# EAGLE design DotLight (EAGLE 7.7.0)

## Sheet 1 of 3
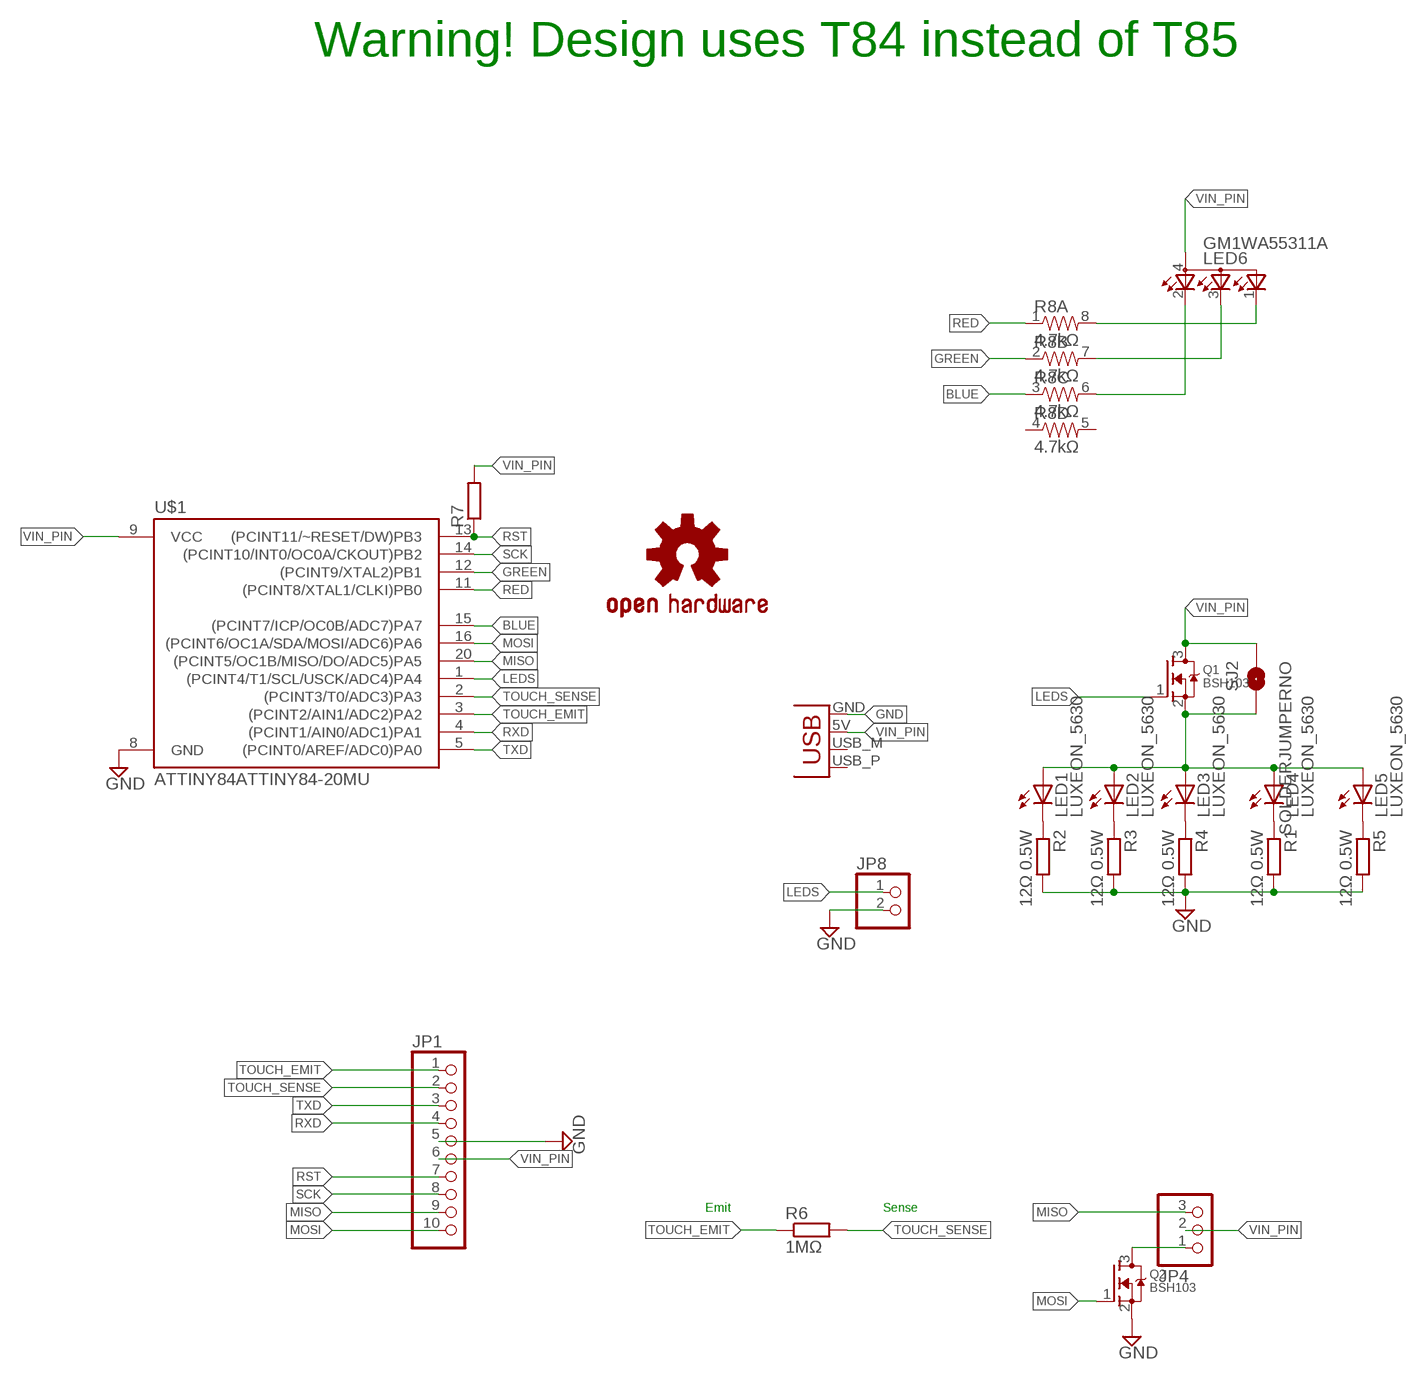
[diagram p0: schematic, sheet 1]

### Parts
JP1  PINHD-1X10  [1X10]
JP3  USBPCB  [USB-A-PCB]
JP4  PINHD-1X3  [1X03]
JP8  PINHD-1X2  [1X02]
LED1  LUXEON_5630  [LUXEON_5630]
LED2  LUXEON_5630  [LUXEON_5630]
LED3  LUXEON_5630  [LUXEON_5630]
LED4  LUXEON_5630  [LUXEON_5630]
LED5  LUXEON_5630  [LUXEON_5630]
LED6  GM1WA55311A  [GM1WA55311A]
LOGO1  OSHW-LOGOS  [OSHW-LOGO-S]
Q1  BSH103  MOSFET-NREFLOW  [SOT23]
Q2  BSH103  MOSFET-NREFLOW  [SOT23]
R1  12Ω 0.5W  R-EU_R1210  [R1210]
R2  12Ω 0.5W  R-EU_R1210  [R1210]
R3  12Ω 0.5W  R-EU_R1210  [R1210]
R4  12Ω 0.5W  R-EU_R1210  [R1210]
R5  12Ω 0.5W  R-EU_R1210  [R1210]
R6  1MΩ  R-EU_R1206  [R1206]
R7  R-EU_R0603  [R0603]
R8  4.7kΩ  RESISTOR-ARRAY0603-ARV  [0603-ARV]
SJ2  SOLDERJUMPERNO  [SJ_2S-NO]
U$1  ATTINY84ATTINY84-20MU  [QFN20]

### Nets
BLUE: R8.3 U$1.15((PCINT7/ICP/OC0B/ADC7)PA7)
GND: JP1.5 JP3.GND JP8.2 Q2.2(S) R1.2 R2.2 R3.2 R4.2 R5.2 U$1.8(GND)
GO: LED1.A LED2.A LED3.A LED4.A LED5.A Q1.2(S) SJ2.2
GREEN: R8.2 U$1.12((PCINT9/XTAL2)PB1)
LED_R1: LED4.C R1.1
LED_R2: LED1.C R2.1
LED_R3: LED2.C R3.1
LED_R4: LED3.C R4.1
LED_R5: LED5.C R5.1
LEDS: JP8.1 Q1.1(G) U$1.1((PCINT4/T1/SCL/USCK/ADC4)PA4)
MISO: JP1.9 JP4.3 U$1.20((PCINT5/OC1B/MISO/DO/ADC5)PA5)
MOSI: JP1.10 Q2.1(G) U$1.16((PCINT6/OC1A/SDA/MOSI/ADC6)PA6)
N$1: LED6.2(CRED) R8.6
N$2: LED6.3(CBLUE) R8.7
N$3: JP4.1 Q2.3(D)
N$4: LED6.1(CGREEN) R8.8
RED: R8.1 U$1.11((PCINT8/XTAL1/CLKI)PB0)
RST: JP1.7 R7.1 U$1.13((PCINT11/~RESET/DW)PB3)
RXD: JP1.4 U$1.4((PCINT1/AIN0/ADC1)PA1)
SCK: JP1.8 U$1.14((PCINT10/INT0/OC0A/CKOUT)PB2)
TOUCH_EMIT: JP1.1 R6.1 U$1.3((PCINT2/AIN1/ADC2)PA2)
TOUCH_SENSE: JP1.2 R6.2 U$1.2((PCINT3/T0/ADC3)PA3)
TXD: JP1.3 U$1.5((PCINT0/AREF/ADC0)PA0)
VIN_PIN: JP1.6 JP3.5V(VBUS) JP4.2 LED6.4(A) Q1.3(D) R7.2 SJ2.1 U$1.9(VCC)
Unconnected: JP3.USB_M(D-) JP3.USB_P(D+) R8.4 R8.5

### Notes on the sheet
- Warning! Design uses T84 instead of T85
- Emit | Sense

## Sheet 2 of 3
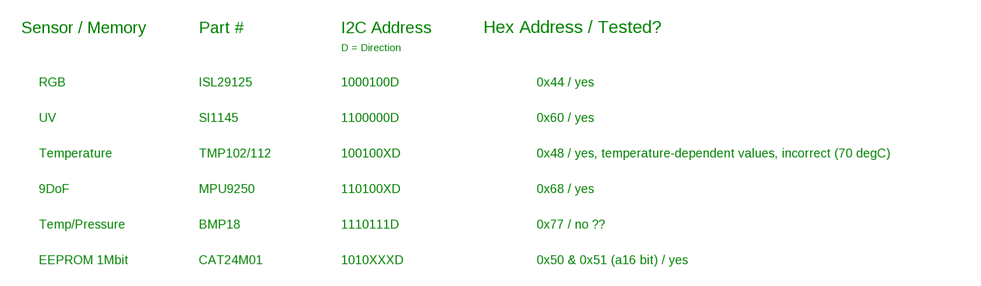
[diagram p1: schematic, sheet 2]

### Notes on the sheet
- Sensor / Memory | Part # | I2C Address | Hex Address / Tested?
- D = Direction
- RGB | ISL29125 | 1000100D | 0x44 / yes
- UV | SI1145 | 1100000D | 0x60 / yes
- Temperature | TMP102/112 | 100100XD | 0x48 / yes, temperature-dependent values, incorrect (70 degC)
- 9DoF | MPU9250 | 110100XD | 0x68 / yes
- Temp/Pressure | BMP18 | 1110111D | 0x77 / no ??
- EEPROM 1Mbit | CAT24M01 | 1010XXXD | 0x50 & 0x51 (a16 bit) / yes

## Sheet 3 of 3
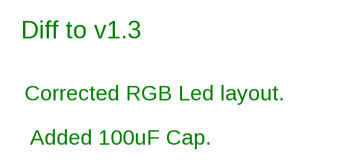
[diagram p2: schematic, sheet 3]

### Notes on the sheet
- Diff to v1.3
- Corrected RGB Led layout.
- Added 100uF Cap.

## Library data of the parts
JP1 = pinhead:PINHD-1X10: PIN HEADER
JP3 = Spark:USB
JP4 = pinhead:PINHD-1X3: PIN HEADER
JP8 = pinhead:PINHD-1X2: PIN HEADER
LED1-LED5 = HighPowerLed:LUXEON_5630: LUXEON 5630 Mid-Power LEDs SD201 Source: Data sheet <www.philipslumileds.com/uploads/351/DS201-pdf> Lumileds 5630 Datasheet DS201 20130228 ©2013 Philips Lumileds Lighting Company.
LED6 = led:GM1WA55311A: Chip LED RGB Source: http://document.sharpsma.com/files/GM1WA55311A_SS.pdf
LOGO1 = Particle-Devices:OSHW-LOGO: Open Source Hardware Logo This logo indicates the piece of hardware it is found on incorporates a OSHW license and/or adheres to the definition of open source hardware found here: http://freedomdefined.org/OSHW
Q1 Q2 = adafruit:MOSFET-N: N-Channel Mosfet 2N7002E - 60V 260mA SOT23 [Digikey: 2N7002ET1GOSTR-ND] - REEL BSH103 - 30V 850mA SOT23 [Digikey: 568-5013-1-ND]
R1-R6 = resistor:R-EU_: RESISTOR, European symbol
R7 = rcl:R-EU_: RESISTOR, European symbol
R8 = SparkFun:RESISTOR-ARRAY: Array Chip Resistor Source: RS Component / Phycomp
SJ2 = SparkFun-Retired:SOLDERJUMPER: Solder Jumper Standard SMD solder jumper. Used to automate production. Two varients : Normally Open and Normally Closed are the same, but have different paste layers. NC will have a large amount of paste and should jumper during reflow.
U$1 = SparkFun-IC-Microcontroller:ATTINY84: Atmel 14-pin 2/4/8kB flash uC Datasheet <https://cdn.sparkfun.com/datasheets/Widgets/doc8006.pdf> SparkFun Products Tiny AVR Programmer <https://www.sparkfun.com/products/11801> (PGM-11801) SparkFun Servo Trigger - Continuous Rotation <https://www.sparkfun.com/products/13872> (WIG-13872) SparkFun Servo Trigger <https://www.sparkfun.com/products/13118> (WIG-13118)

## Board
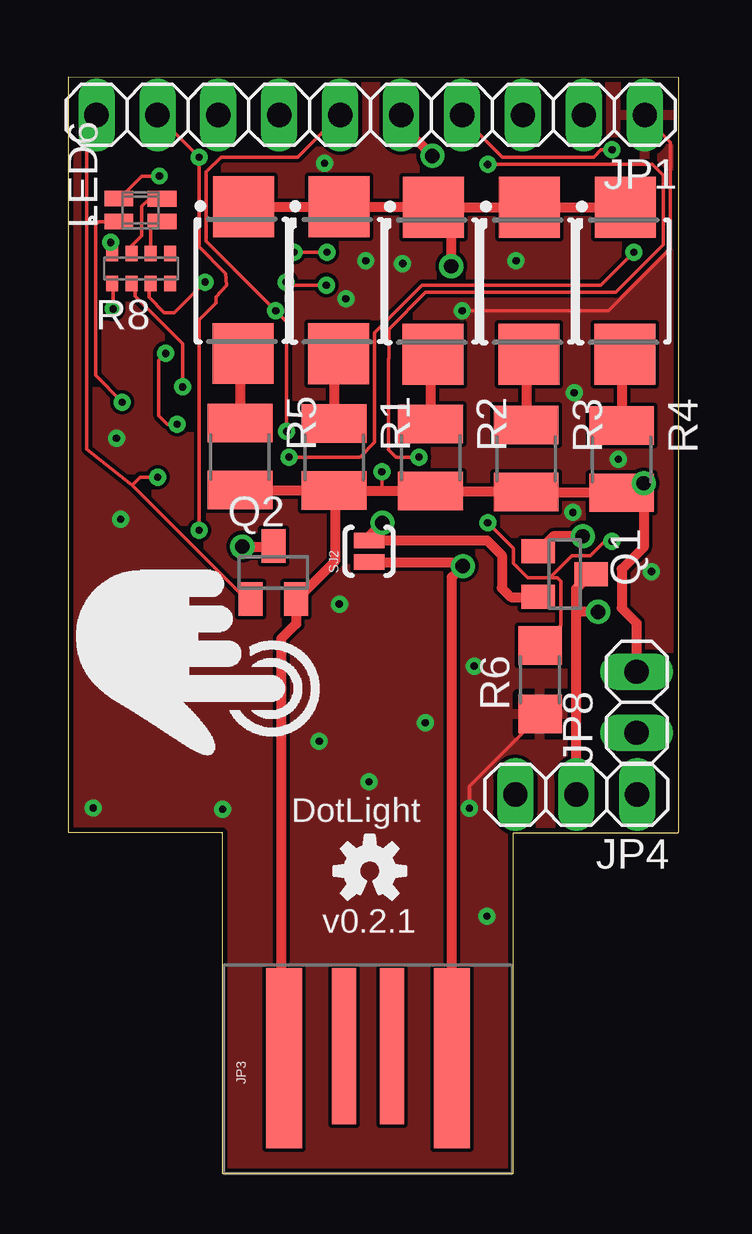
[diagram p3: board, top side]
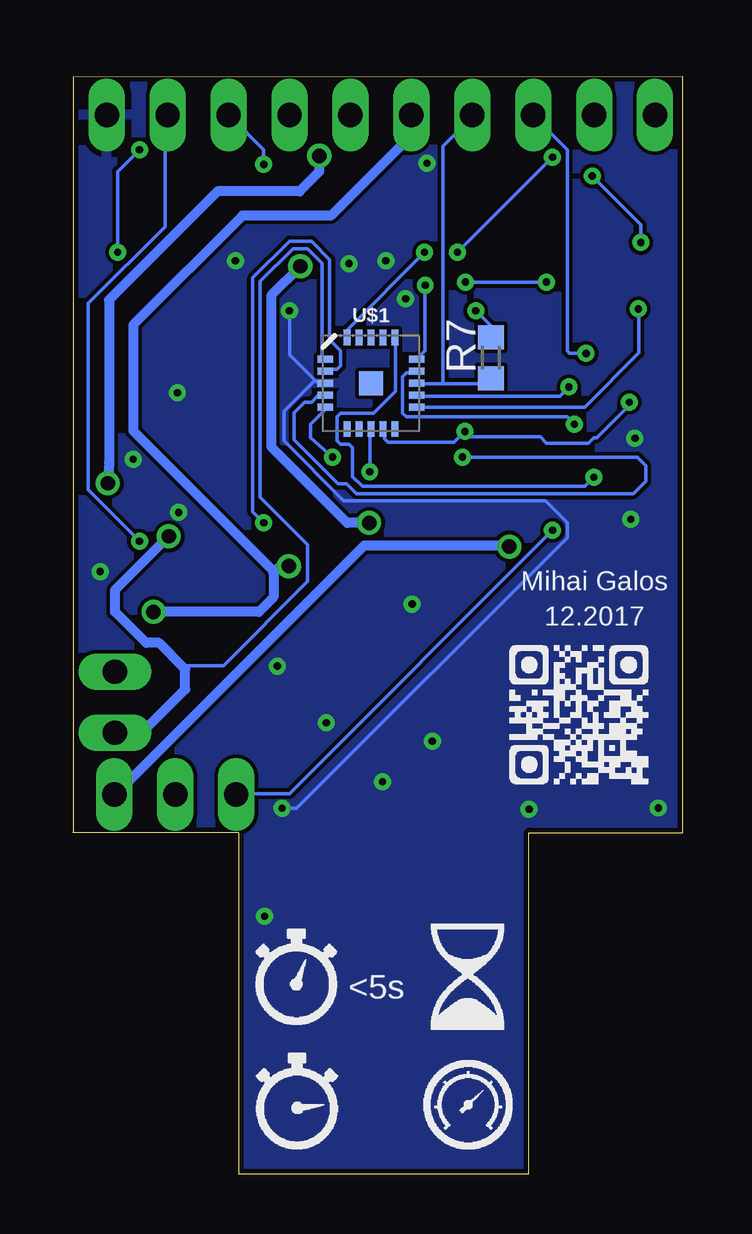
[diagram p4: board, bottom side, seen from below]

Size 25.43 x 45.71 mm. Coordinates in mm from the lower left corner, seen from the top.
Outline: 0,14.22 0,45.71 25.43,45.7 25.42,14.23
Outline: 6.42,14.21 6.42,0 18.52,0 18.52,14.21
Outline: 18.52,14.22 25.42,14.22 25.42,14.24
Outline: 6.42,14.22 0,14.22 0,14.23
Copper layers (1*16): Top 0.035mm / dielectric 1.5mm / Bottom 0.035mm
Design rules "Mihai_default": minimum track width 6mil, minimum drill 0.3mm, track to track 6mil, track to pad 6mil, pad to pad 6mil, via to via 6mil, smd to smd 6mil, copper to edge 8mil, drill to drill 8mil, minimum pad ring 10mil, minimum via ring 8mil, stop-mask expansion 4mil, vias tented up to drill 0mil, thermal gap 10mil

### Footprints (pad centres in the part's own frame; a part is rotated, then mirrored left to right if it is on the bottom)
1X10 = drill 1.016 long: 1 -11.43,0; 2 -8.89,0; 3 -6.35,0; 4 -3.81,0; 5 -1.27,0; 6 1.27,0; 7 3.81,0; 8 6.35,0; 9 8.89,0; 10 11.43,0
USB-A-PCB = smd 7.5 x 1.5: 5V -0.2,-3.5; GND -0.2,3.5 | smd 6.5 x 1: USB_M 0.3,-1; USB_P 0.3,1
1X03 = drill 1.016 long: 1 -2.54,0; 2 0,0; 3 2.54,0
1X02 = drill 1.016 long: 1 -1.27,0; 2 1.27,0
LUXEON_5630 = smd 2.54 x 2.54: A -3.073,0.076; C 3.048,0.051
GM1WA55311A = smd 0.65 x 1.2: 1 0.477,0.9; 2 -0.475,-0.9; 3 0.475,-0.9; 4 -0.477,0.9
SOT23 = smd 1 x 1.4: 1 -0.95,-1.1; 2 0.95,-1.1; 3 0,1.1
R1210 = smd 1.6 x 2.7: 1 -1.4,0; 2 1.4,0
R1206 = smd 1.6 x 1.803: 1 -1.422,0; 2 1.422,0
R0603 = smd 1 x 1.1: 1 -0.85,0; 2 0.85,0
0603-ARV = smd 0.5 x 0.65: 1 -1.2,-0.625; 2 -0.4,-0.625; 3 0.4,-0.625; 4 1.2,-0.625; 5 1.2,0.625; 6 0.4,0.625; 7 -0.4,0.625; 8 -1.2,0.625
SJ_2S-NO = smd 0.635 x 1.27: 1 -0.45,0; 2 0.45,0
QFN20 = smd 1 x 1: 0 0,0 | smd 0.65 x 0.3: 1 -1.9,1; 2 -1.9,0.5; 3 -1.9,0; 4 -1.9,-0.5; 5 -1.9,-1; 11 1.9,-1; 12 1.9,-0.5; 13 1.9,0; 14 1.9,0.5; 15 1.9,1 | smd 0.3 x 0.65: 6 -1,-1.9; 7 -0.5,-1.9; 8 0,-1.9; 9 0.5,-1.9; 10 1,-1.9; 16 1,1.9; 17 0.5,1.9; 18 0,1.9; 19 -0.5,1.9; 20 -1,1.9

### Placement (x,y rotation side)
JP1  12.6,44.12 180 top
JP3  12.48,5.01 90 top
JP4  21.17,15.8 180 top
JP8  23.69,19.65 90 top
LED1  15.14,37.2 270 top
LED2  19.14,37.2 270 top
LED3  23.14,37.2 270 top
LED4  11.2,37.22 270 top
LED5  7.23,37.23 270 top
LED6  3,40.15 90 top
LOGO1  12.56,12.61 0 top
Q1  20.68,24.99 270 top
Q2  8.54,25.06 0 top
R1  11.07,29.87 270 top
R2  15.09,29.85 270 top
R3  19.08,29.81 270 top
R4  23.06,29.78 270 top
R5  7.15,29.89 270 top
R6  19.66,20.59 90 top
R7  8.01,34 90 bottom
R8  3.03,37.71 0 top
SJ2  12.53,25.94 90 top
U$1  13.01,32.94 0 bottom

### Tracks (layer width: path | path; a pad name or v marks a point on that pad's centre or on a via)
BLUE  (via drill 0.3)
  Top 0.152: v10.75,37.03 9.2,37.03 v9.07,37.15 | v5.69,37.15 5.67,37.15 4.4,35.88 3.99,35.88 3.36,36.52 3.36,37.02 R8.3
  Bottom 0.152: U$1.15 10.75,34.3 v10.75,37.03 | v9.07,37.15 v5.69,37.15
GND  (via drill 0.3, 0.6)
  Top 0.152: 13.06,28.47 v13.06,29.25
  Top 0.406: R5.2 11.07,28.49 R1.2 | R1.2 13.06,28.47 15.09,28.47 R2.2 19.08,28.45 R3.2 23.06,28.41 R4.2 23.98,28.38 v23.98,28.77 23.98,26.1 23.07,25.19 23.07,23.57 23.69,22.94 JP8.2 | R1.2 11.13,28.41 11.13,25.55 9.54,23.96 Q2.2 9.49,22.92 8.87,22.29 8.87,4.92 JP3.GND | JP1.5 13.87,43.71 v15.17,42.41
  Bottom 0.152: v13.06,29.25 13.06,30.93 U$1.8
  Bottom 0.406: v15.17,42.41 15.17,41.75 15.98,40.94 19.41,40.94 23.93,36.42 23.93,29.64 v23.98,28.77
GO  (via drill 0.6)
  Top 0.406: LED5.A 11.28,40.3 LED4.A 15.22,40.29 LED1.A | LED1.A LED2.A LED3.A | Q1.2 19.57,24.02 18.45,24.02 18.06,24.4 18.06,25.77 17.45,26.39 SJ2.2 12.53,26.57 v13.09,27.12 | v15.96,37.81 15.96,39.53 LED1.A
  Bottom 0.406: v13.09,27.12 14,27.12 17.15,30.27 17.15,36.62 v15.96,37.81
GREEN  (via drill 0.3)
  Top 0.152: v4.76,32.79 4.76,34.59 2.77,36.57 2.77,36.94 R8.2
  Bottom 0.152: U$1.12 10.9,32.44 10.9,32.4 5.13,32.39 v4.76,32.79
LED_R1
  Top 0.406: LED4.C 11.07,34.17 R1.1
LED_R2
  Top 0.406: LED1.C 15.09,34.15 R2.1
LED_R3
  Top 0.406: LED2.C 19.08,34.15 R3.1
LED_R4
  Top 0.406: LED3.C 23.06,34.15 R4.1
LED_R5
  Top 0.406: LED5.C 7.15,34.18 R5.1
LEDS  (via drill 0.6)
  Top 0.406: v21.44,26.56 20.21,26.56 Q1.1
  Bottom 0.152: U$1.1 15.04,33.98 15.04,37.94 15.65,38.55 16.26,38.55 17.63,37.18 17.63,28.19 15.65,26.21 15.65,24.68 19.16,21.18 20.68,21.18 20.8,21.06
  Bottom 0.406: v21.44,26.56 23.69,24.31 23.68,24.3 23.68,23.41 22.38,22.12 21.85,22.12 20.8,21.06 20.76,21.02 20.76,20.19 22.57,18.38 JP8.1
MISO  (via drill 0.3)
  Top 0.152: v9.4,38.4 v10.77,38.4 | JP1.9 3.76,44.04 v5.44,42.36 5.44,38.63 6.56,37.51 6.58,37.03 6.15,36.54 6.15,36.29 5.44,35.58 v5.44,26.82
  Bottom 0.152: v10.77,38.4 13.98,35.2 13.98,34.89 U$1.20 | v5.44,42.36 v9.4,38.4 | v5.44,26.82 16.41,15.84 18.55,15.84 JP4.3
MOSI  (via drill 0.3)
  Top 0.152: 2.65,28.7 0.77,30.19 0.77,44.06 JP1.10 | 2.65,28.7 7.27,24.07 7.57,24.07 Q2.1 | v3.71,29.03 2.98,29.03 2.65,28.7
  Bottom 0.152: U$1.16 11.99,34.74 11.99,32.61 12.91,31.69 14.28,31.69 14.43,31.54 14.43,30.55 14.28,30.4 13.92,30.4 13.77,30.25 13.77,29.05 13.37,28.64 4.09,28.64 v3.71,29.03 | 1.17,44.04 JP1.10
N$1
  Top 0.152: LED6.2 3.43,39.68 R8.6
N$2
  Top 0.152: R8.7 2.63,38.66 3.05,39.08 3.05,40.3 3.33,40.58 3.86,40.58 LED6.3
N$3  (via drill 0.6)
  Top 0.406: v7.24,26.13 8.52,26.13 Q2.3
  Bottom 0.406: JP4.1 23.67,15.8 13.29,26.18 7.3,26.18 v7.24,26.13
N$4  (via drill 0.3)
  Top 0.152: R8.8 1.83,38.73 v1.76,38.8 | v3.79,41.57 3.05,41.57 LED6.1
  Bottom 0.152: v1.76,38.8 1.76,39.54 v3.79,41.57
RED  (via drill 0.3)
  Top 0.152: v1.86,36.04 1.86,37.06 R8.1
  Bottom 0.152: U$1.11 4.86,31.94 4.86,31.95 4.09,31.95 1.83,34.21 1.83,36.01 v1.86,36.04
RST
  Bottom 0.152: 8.03,32.91 10.01,32.91 | 10.01,32.91 11.08,32.91 U$1.13 | 7.73,33.22 8.03,32.91 | 10.01,32.91 10.01,42.82 8.79,44.04 JP1.7 | 8.03,32.91 8.01,32.91 R7.1
RXD  (via drill 0.3)
  Top 0.152: v23.58,38.4 22.2,37.03 14.74,37.03 12.76,35.05 12.76,30.47 12.15,29.86 v9.2,29.86 | v22.66,42.67 22.2,42.67 21.9,42.36 18.09,42.36 16.41,44.04 JP1.4
  Bottom 0.152: v23.58,38.4 23.58,41.75 v22.66,42.67 | U$1.4 15.04,32.45 15.19,32.45 15.5,32.15 15.78,32.15 16.21,31.72 16.21,30.58 14.38,28.75 14.03,28.75 13.62,28.34 2.06,28.34 1.55,28.85 1.55,29.51 1.91,29.86 v9.2,29.86
SCK  (via drill 0.3)
  Top 0.152: v4.53,31.24 4.12,31.24 3.76,31.59 3.76,33.9 v4.04,34.18
  Bottom 0.152: U$1.14 11.23,33.37 11.54,33.37 11.69,33.22 11.69,31.69 11.54,31.54 4.83,31.54 v4.53,31.24 | JP1.8 6.2,44.04 4.83,42.67 4.83,34.28 4.73,34.18 v4.04,34.18
TOUCH_EMIT  (via drill 0.3)
  Top 0.152: v16.41,35.96 22.51,35.96 25.1,38.55 25.1,42.97 24.03,44.04 JP1.1 | v16.72,15.23 16.72,16.15 19.61,19.04 R6.1
  Bottom 0.152: 15.35,33.06 16.41,34.13 v16.41,35.96 | 15.35,33.06 15.19,32.91 15.04,32.91 U$1.3 | v16.72,15.23 16.11,15.23 4.83,26.51 4.83,27.12 5.75,28.04 14.15,28.04 16.64,30.55 16.64,31.77 15.35,33.06
  other vias: 10.45,18.02 11.29,23.74 2.18,27.27 11.56,36.45 12.39,38.04 13.93,37.93 18.66,38.04 21.08,32.54 24.31,25.09 17.45,10.73 12.53,16.34 6.42,15.19 10.67,42.11 21.03,27.56 22.93,29.78 14.87,18.79 16.92,21.16 1.03,15.24 2,30.65
  pour Bottom: 0.34,14.4 6.43,14.4 6.43,-0.08 18.62,-0.08 18.62,14.01 25.48,14.01 25.48,14.4 25.48,46.02 -0.05,46.02 -0.05,14.01 0.34,14.01
  pour Top: -0.05,14.4 6.43,14.4 6.43,-0.08 18.62,-0.08 18.62,14.01 25.48,14.01 25.48,45.64 -0.05,45.64
TOUCH_SENSE  (via drill 0.3)
  Top 0.152: v17.48,27.12 18.55,26.05 18.55,25.44 19.16,24.83 20.07,24.83 | 20.07,24.83 20.38,24.83 20.53,24.68 20.53,22.85 19.77,22.09 R6.2 | v22.66,26.36 22.36,26.36 21.75,25.75 20.99,25.75 20.07,24.83
  Bottom 0.152: v17.48,27.12 17.94,27.58 17.94,37.33 16.41,38.86 15.5,38.86 14.74,38.09 14.74,34.74 14.28,34.28 14.28,33.67 14.43,33.52 14.89,33.52 U$1.2 | v22.66,26.36 24.8,28.49 24.8,36.26 21.6,39.47 21.6,44.04 JP1.2
TXD  (via drill 0.3)
  Top 0.152: v17.48,42.06 24.34,42.06 24.8,41.6 24.8,38.7 22.81,36.72 14.89,36.72 13.37,35.2 13.37,33.98 13.34,33.95 13.34,30.17 13.65,29.86 v14.61,29.86
  Bottom 0.152: v17.48,42.06 17.48,42.67 18.85,44.04 JP1.3 | U$1.5 14.89,32 14.89,31.87 15.52,31.24 15.52,30.68 v14.61,29.86
VIN_PIN  (via drill 0.3, 0.6)
  Top 0.152: v9.1,30.93 9.1,35.5 v8.64,35.96 5.75,38.86 5.75,41.75 6.36,42.36 9.56,42.36 11.23,44.04 JP1.6 | LED6.4 1.25,39.67 1.12,39.54 1.12,33.27 v2.24,32.15
  Top 0.406: JP4.2 21.17,23.54 | 21.17,23.54 21.17,24.38 Q1.3 | v22.08,23.41 21.3,23.41 21.17,23.54 | JP3.5V 15.98,24.86 v16.44,25.32 16.27,25.49 SJ2.1
  Bottom 0.152: U$1.9 12.45,30.93 12.45,30.63 12.3,30.47 9.56,30.47 v9.1,30.93 8.87,30.7 5.95,30.7 5.69,30.45 3.94,30.45 3.71,30.68 3.59,30.68 2.24,32.02 v2.24,32.15 | v8.64,35.96 7.8,35.12 | 7.8,35.12 7.73,35.05 | R7.2 7.8,34.85 7.8,35.12
  Bottom 0.406: JP1.6 11.33,43.28 14.69,39.92 18.37,39.92 22.92,35.38 22.92,30.96 17.07,25.11 17.07,25.04 | 17.07,25.04 17.07,24.02 17.68,23.41 v22.08,23.41 | v16.44,25.32 16.79,25.32 17.07,25.04

### Text on the board
tPlace: DotLight | v0.2.1
bPlace: Mihai Galos | 12.2017 | <5s
tDocu: LEDS ENABLE | PIR
200bmp: C:/Users/Mihai/Downloads/stopwatch.bmp